# Altium schematic sheet CAN_Connections.SchDoc
size A
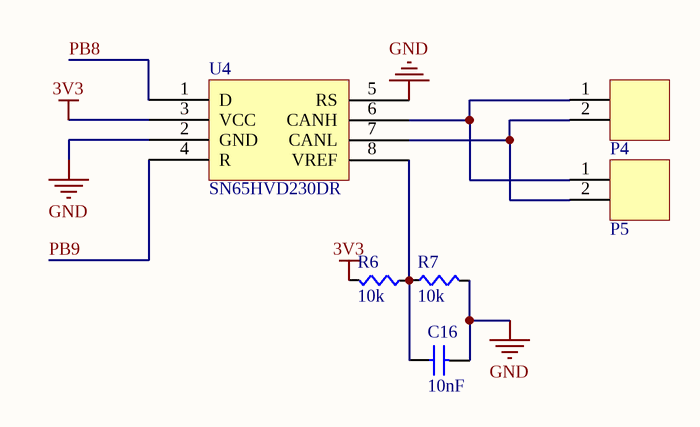
[diagram p0: CAN_Connections.SchDoc]

## Parts
C16  value 10nF  [CAPC0603]  (hidden comment: Cap)
P4  2-pin Horz Sherlock  [MOLEX-HDR-1X2-SHERLOCK-HORZ]  (value not drawn)
P5  2-pin Horz Sherlock  [MOLEX-HDR-1X2-SHERLOCK-HORZ]  (value not drawn)
R6  value 10k  [RES0603]  (hidden comment: Res)
R7  value 10k  [RES0603]  (hidden comment: Res)
U4  SN65HVD230DR  [SOIC-8pin]

## Nets
3V3: R6.1(A) U4.3(VCC)
GND: C16.2(B) R7.1(A) U4.2(GND) U4.5(RS)
PB8: U4.1(D)
PB9: U4.4(R)
NetC16_1: C16.1(A) R6.2(B) R7.2(B) U4.8(VREF)
NetP4_1: P4.1 P5.1 U4.6(CANH)
NetP4_2: P4.2 P5.2 U4.7(CANL)

## Library data of the parts
P4 P5 = MOLEX-HDR-1x2-SHERLOCK_RA: Header, Molex, 2mm Pitch Sherlock Header, Single Row, Horizontal, 2 Circuits, Length 3.3mm,  0353630260; Manufacturer: Molex Inc; Manufacturer Part Number: 0353630260; Supplier Part Number 1: WM18931-ND; Supplier 1: Digi-Key
U4 = SN65HVD230DR: IC TXRX CAN 1MBPS 3.3V 8SOIC; Supplier 1: Digi-Key; Supplier Part Numbe 1: 296-11654-1-ND
C16 = Cap: Supplier 1: Digi-Key; Supplier Part Number 1: 1276-1000-1-ND
R6 R7 = Res: Supplier 1: Digi-Key; Supplier Part Number 1: RMCF0603JT10K0CT-ND